# EAGLE design Codeshelf-0007.v03 (EAGLE 6.5.0)
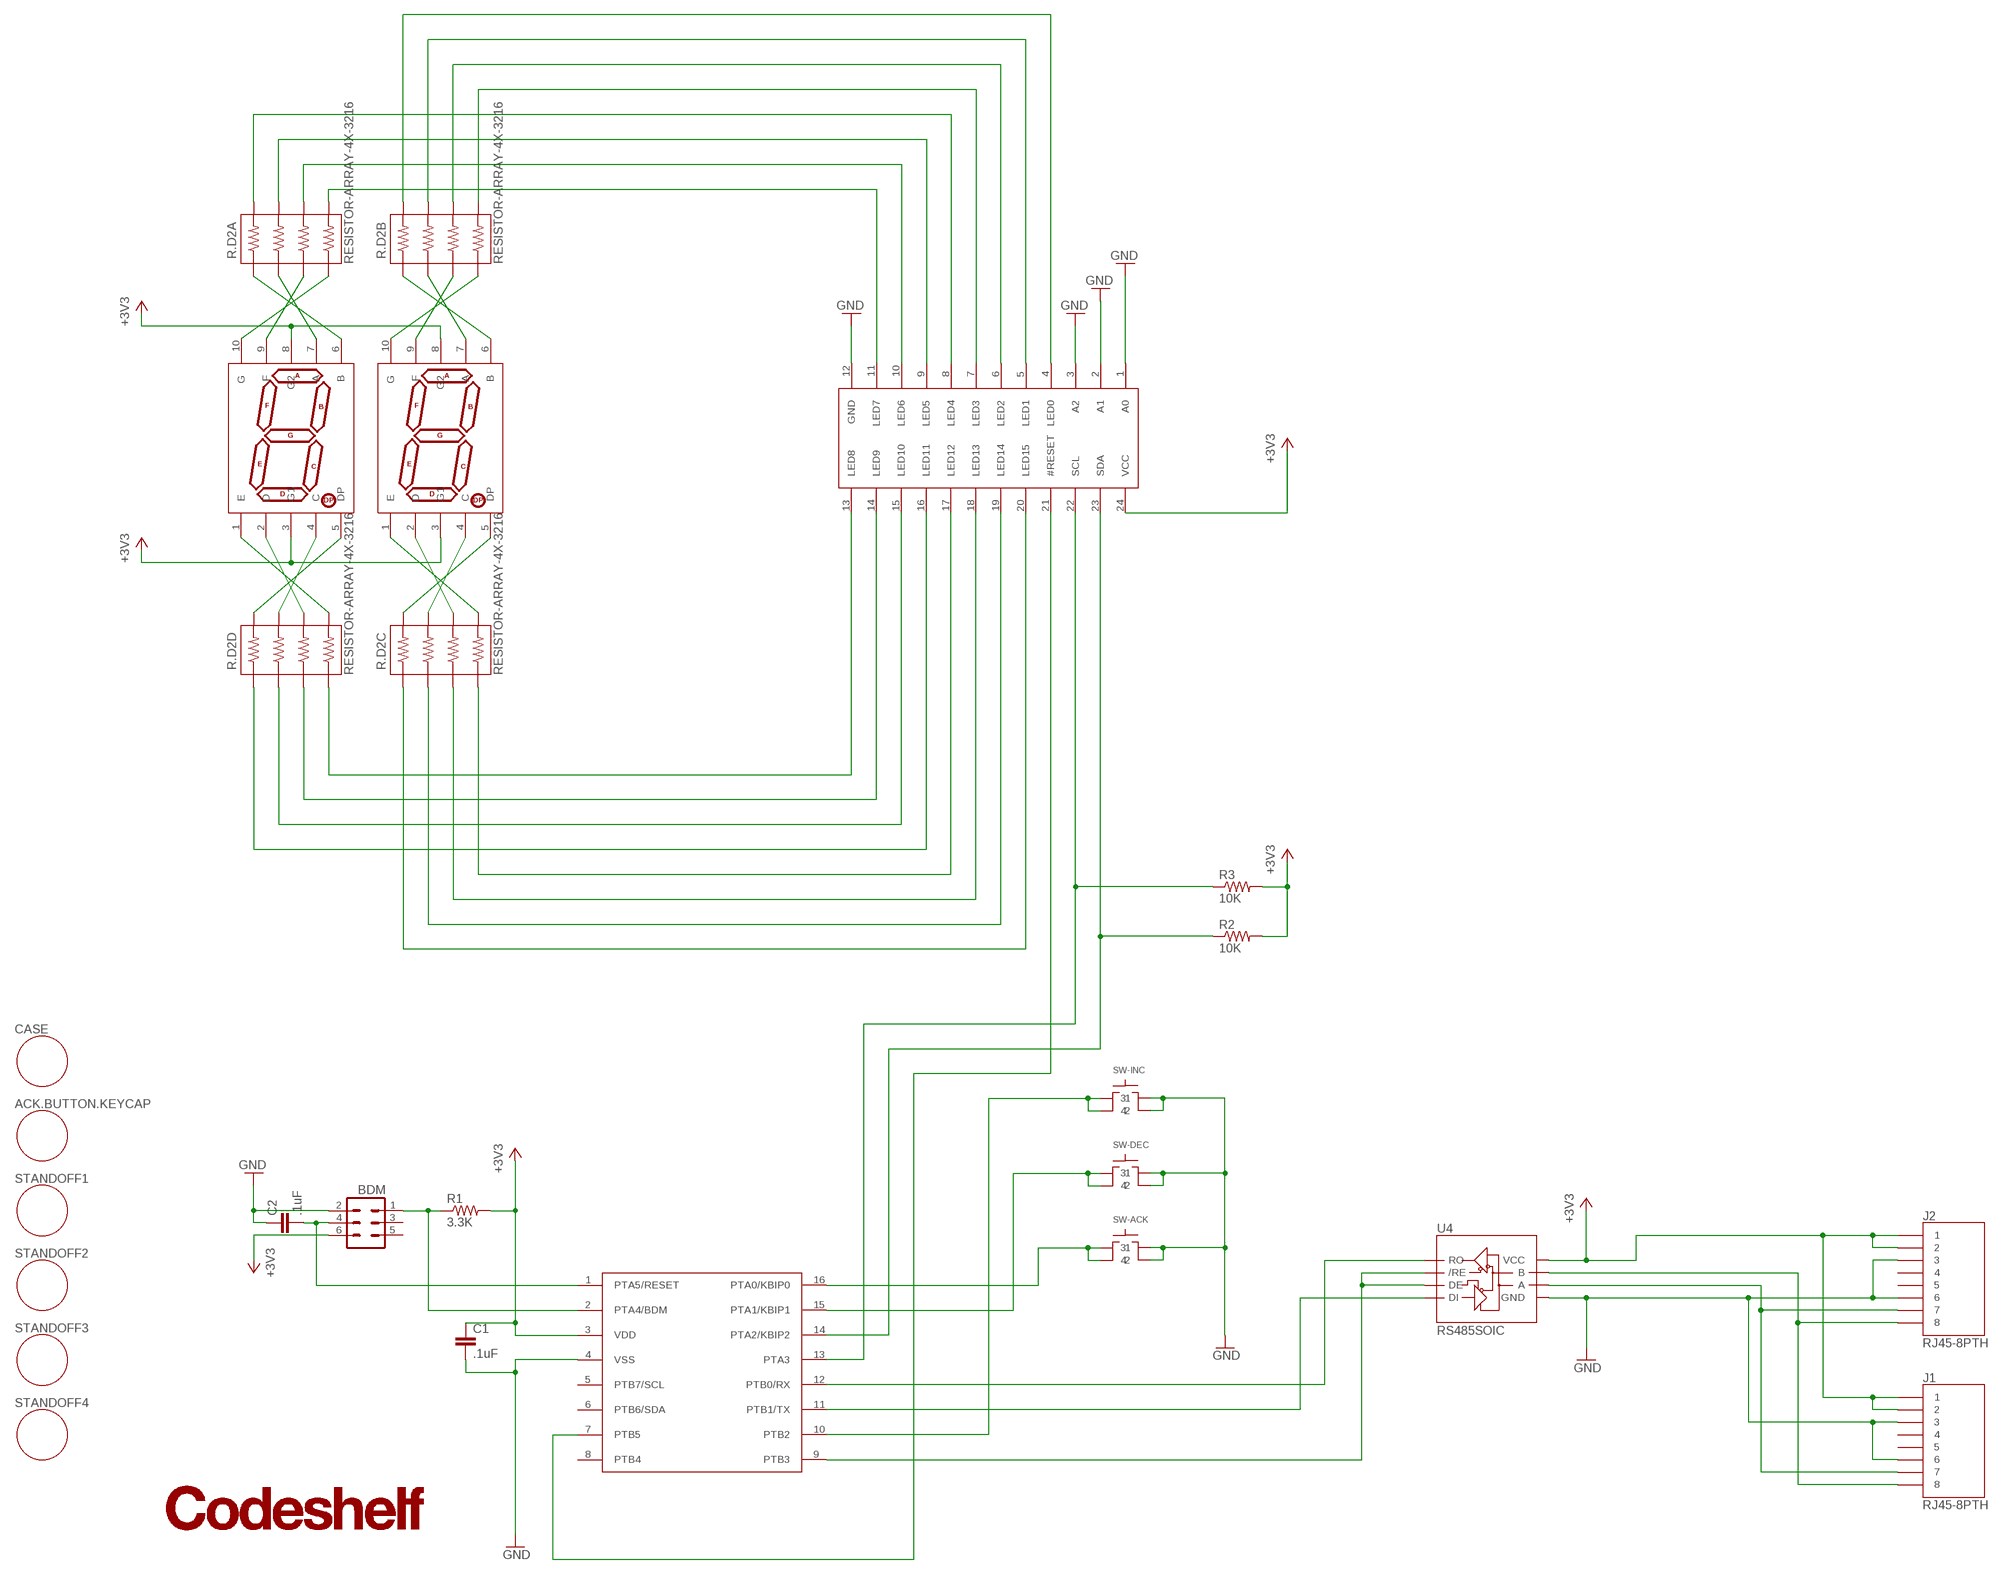
[diagram p0: schematic, sheet 1]

## Parts
ACK.BUTTON.KEYCAP  EXTERNAL-COMPONENT  [EXTERNAL-COMPONENT]
BDM  HEADER-3X2  [HEADER-3X2]
C1  .1uF  RF-C0402  [C0402]
C2  .1uF  RF-C0402  [C0402]
CASE  EXTERNAL-COMPONENT  [EXTERNAL-COMPONENT]
J1  RJ45-8PTH  [RJ45-8]
J2  RJ45-8PTH  [RJ45-8]
LED1  7SEGMENT-1DIGITSMD  [7SEGMENT-1DIG-.40-SMD]
LED2  7SEGMENT-1DIGITSMD  [7SEGMENT-1DIG-.40-SMD]
LOGO  CODESHELF-LOGO  [CODESHELF-LOGO]
R1  3.3K  RF-R0402  [RF-R0402]
R2  10K  RF-R0402  [RF-R0402]
R3  10K  RF-R0402  [RF-R0402]
R.D2A  RESISTOR-ARRAY-4X-3216  [3216-4X]
R.D2B  RESISTOR-ARRAY-4X-3216  [3216-4X]
R.D2C  RESISTOR-ARRAY-4X-3216  [3216-4X]
R.D2D  RESISTOR-ARRAY-4X-3216  [3216-4X]
STANDOFF1  EXTERNAL-COMPONENT  [EXTERNAL-COMPONENT]
STANDOFF2  EXTERNAL-COMPONENT  [EXTERNAL-COMPONENT]
STANDOFF3  EXTERNAL-COMPONENT  [EXTERNAL-COMPONENT]
STANDOFF4  EXTERNAL-COMPONENT  [EXTERNAL-COMPONENT]
SW-ACK  SWITCH-TACTILE-320.03E11  [SWITCH-TACTILE-320.03E11]
SW-DEC  SWITCH-TACTILE-FSM  [SWITCH-TACTILE-FSM]
SW-INC  SWITCH-TACTILE-FSM  [SWITCH-TACTILE-FSM]
U2  MC9S08QG-DT  [TSSOP16]
U3  CAT9552  [TSSOP24]
U4  RS485SOIC  [SO08]

## Nets
+3V3 [+3V3]: BDM.6 C1.1 J1.1 J1.2 J2.1 J2.2 LED1.3(G1) LED1.8(G2) LED2.3(G1) LED2.8(G2) R1.2 R2.2 R3.2 U2.3(VDD) U3.24(VCC) U4.8(VCC)
GND [GND]: BDM.2 C1.2 C2.1 J1.3 J1.6 J2.3 J2.6 SW-ACK.P$3 SW-ACK.P$4 SW-DEC.P$3 SW-DEC.P$4 SW-INC.P$3 SW-INC.P$4 U2.4(VSS) U3.1(A0) U3.2(A1) U3.3(A2) U3.12(GND) U4.5(GND)
N$1: R.D2A.5(4B) U3.11(LED7)
N$2: R.D2A.6(3B) U3.10(LED6)
N$3: R.D2A.7(2B) U3.9(LED5)
N$4: R.D2A.8(1B) U3.8(LED4)
N$5: R.D2B.5(4B) U3.7(LED3)
N$6: SW-ACK.P$1 SW-ACK.P$2 U2.16(PTA0/KBIP0)
N$7: SW-DEC.P$1 SW-DEC.P$2 U2.15(PTA1/KBIP1)
N$8: SW-INC.P$1 SW-INC.P$2 U2.10(PTB2)
N$9: BDM.1 R1.1 U2.2(PTA4/BDM)
N$10: R.D2B.6(3B) U3.6(LED2)
N$11: R.D2B.7(2B) U3.5(LED1)
N$12: R.D2B.8(1B) U3.4(LED0)
N$13: LED2.6(B) R.D2A.1(1A)
N$14: LED2.7(A) R.D2A.2(2A)
N$15: LED2.9(F) R.D2A.3(3A)
N$16: LED2.10(G) R.D2A.4(4A)
N$17: LED2.5(DP) R.D2D.8(1B)
N$18: LED2.4(C) R.D2D.7(2B)
N$19: U2.9(PTB3) U4.2(/RE) U4.3(DE)
N$20: LED2.2(D) R.D2D.6(3B)
N$21: LED2.1(E) R.D2D.5(4B)
N$22: LED1.6(B) R.D2B.1(1A)
N$23: BDM.4 C2.2 U2.1(PTA5/RESET)
N$24: LED1.7(A) R.D2B.2(2A)
N$25: LED1.9(F) R.D2B.3(3A)
N$26: LED1.10(G) R.D2B.4(4A)
N$27: LED1.5(DP) R.D2C.8(1B)
N$28: LED1.4(C) R.D2C.7(2B)
N$29: LED1.2(D) R.D2C.6(3B)
N$30: LED1.1(E) R.D2C.5(4B)
N$31: R.D2D.4(4A) U3.13(LED8)
N$32: R.D2D.3(3A) U3.14(LED9)
N$33: R.D2D.2(2A) U3.15(LED10)
N$34: R.D2D.1(1A) U3.16(LED11)
N$35: R.D2C.4(4A) U3.17(LED12)
N$36: R.D2C.3(3A) U3.18(LED13)
N$37: R.D2C.2(2A) U3.19(LED14)
N$38: R.D2C.1(1A) U3.20(LED15)
RESET: U2.7(PTB5) U3.21(#RESET)
RS485_N: J1.8 J2.8 U4.7(B)
RS485_P: J1.7 J2.7 U4.6(A)
RX: U2.12(PTB0/RX) U4.1(RO)
SLA: R2.1 U2.14(PTA2/KBIP2) U3.23(SDA)
SLC: R3.1 U2.13(PTA3) U3.22(SCL)
TX: U2.11(PTB1/TX) U4.4(DI)
Unconnected: BDM.3 BDM.5 J1.4 J1.5 J2.4 J2.5 U2.5(PTB7/SCL) U2.6(PTB6/SDA) U2.8(PTB4)

## Library data of the parts
ACK.BUTTON.KEYCAP = GW-devices:EXTERNAL-COMPONENT: Use this device to note external components needed for the BOM; MFGN: ESwitch; MFGP: 320.08RED; PRICE: 0.87
BDM = GW-devices:HEADER-3X2
C1 C2 = GW-devices:RF-C: RF capacitor pads for FSL reference design; MFGN: Murata; MFGP: GRM155R61C104KA88D; PRICE: 0.02
CASE = GW-devices:EXTERNAL-COMPONENT: Use this device to note external components needed for the BOM; MFGN: Bud Industries; MFGP: PN-1321-C; PRICE: 8.50
J1 = GW-devices:RJ45-8: RJ45 Jack MFG part number 54602-908lf; MFGN: FCI; MFGP: 54602-908LF; PRICE: 0.02
J2 = GW-devices:RJ45-8: RJ45 Jack MFG part number 54602-908lf; MFGN: FCI; MFGP: 54602-908LF; PRICE: 0.57
LED1 LED2 = GW-devices:7SEGMENT-1DIGIT
LOGO = GW-devices:CODESHELF-LOGO
R1 = GW-devices:RF-R: RF resistor pads for FSL reference design; MFGN: Panasonic; MFGP: ERJ-2GEJ332X; PRICE: 0.02
R2 R3 = GW-devices:RF-R: RF resistor pads for FSL reference design; MFGN: Panasonic; MFGP: ERJ-2GEJ103X; PRICE: 0.02
R.D2A R.D2B R.D2C R.D2D = GW-devices:RESISTOR-ARRAY-4X; MFGN: Yageo; MFGP: YC164-JR-07120RL; PRICE: 0.006
STANDOFF1-STANDOFF4 = GW-devices:EXTERNAL-COMPONENT: Use this device to note external components needed for the BOM; MFGN: Keystone; MFGP: 24340; PRICE: 0.44
SW-ACK = GW-devices:SWITCH-TACTILE; MFGN: ESwitch; MFGP: 320.03E11
SW-DEC SW-INC = GW-devices:SWITCH-TACTILE; MFGN: TE Connectivity; MFGP: FSM16JH; PRICE: 0.18
U2 = GW-devices:MC9S08QG; MFGN: Freescale; MFGP: MC9S08QG8CDTER; PRICE: 1.73
U3 = GW-devices:CAT9552; MFGN: On Semiconductor; MFGP: CAT9552YI-T2; PRICE: 1.28
U4 = SparkFun:RS485; MFGN: TI; MFGP: SN65HVD1781DR; PRICE: 4.29

## Net classes
1 +3V3: width 0.3 mm
2 GND: width 0.3 mm
3 RS485: width 0.4 mm

## Board
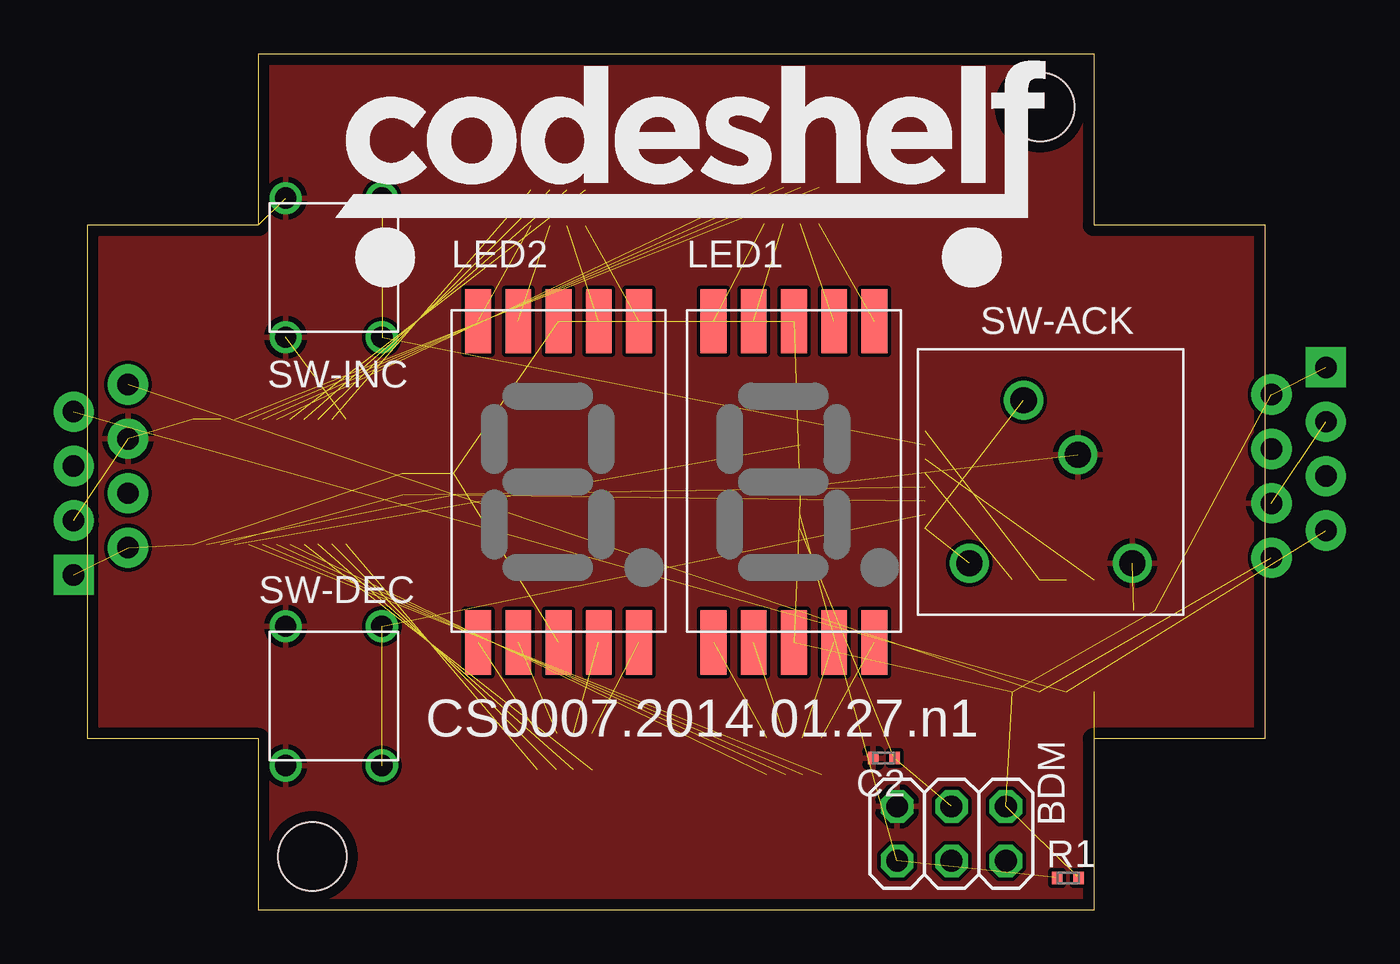
[diagram p1: board, top side]
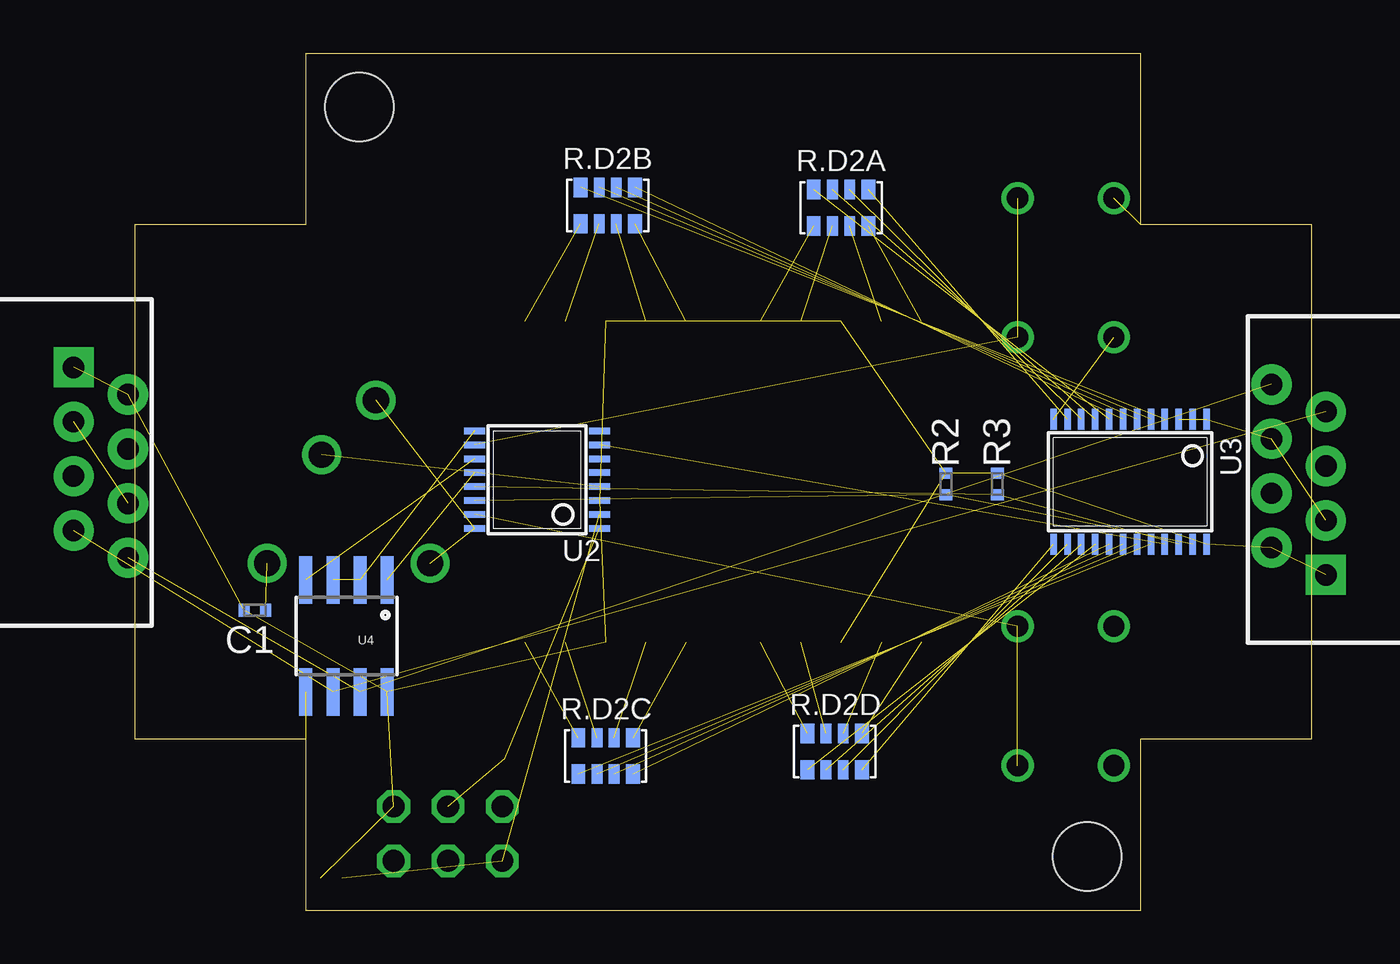
[diagram p2: board, bottom side, seen from below]

Size 55 x 40 mm. Coordinates in mm from the lower left corner, seen from the top.
Outline: 0,8 0,32 8,32 8,40 47,40 47,32 55,32 55,8 47,8 47,0 8,0 8,8 0,8
Copper layers (1*16): Top 0.0356mm / dielectric 1.5011mm / Bottom 0.0356mm
Design rules "SilverCircuits": minimum track width 7mil, minimum drill 14mil, track to track 7mil, track to pad 7mil, pad to pad 7mil, via to via 7mil, smd to smd 0mil, copper to edge 20mil, drill to drill 8mil, minimum pad ring 10mil, minimum via ring 8mil, stop-mask expansion 4mil, vias tented up to drill 0mil, thermal gap 10mil
Holes 3.2 mm at 10.5,2.5 44.5,37.5

### Footprints (pad centres in the part's own frame; a part is rotated, then mirrored left to right if it is on the bottom)
HEADER-3X2 = drill 1.016 octagon: 1 -5.08,0; 2 -5.08,2.54; 3 -2.54,0; 4 -2.54,2.54; 5 0,0; 6 0,2.54
C0402 = smd 0.5 x 0.6: 1 -0.5,0; 2 0.5,0
RJ45-8 = drill 1 pad 1.88 square: 1 -4.445,6.35 | drill 1 pad 1.88: 2 -3.175,8.89; 3 -1.905,6.35; 4 -0.635,8.89; 5 0.635,6.35; 6 1.905,8.89; 7 3.175,6.35; 8 4.445,8.89 | hole 3.2: -5.715,0; 5.715,0
7SEGMENT-1DIG-.40-SMD = smd 1.2 x 3: 1 -3.76,-7.5; 2 -1.88,-7.5; 3 0,-7.5; 4 1.88,-7.5; 5 3.76,-7.5; 6 3.76,7.5; 7 1.88,7.5; 8 0,7.5; 9 -1.88,7.5; 10 -3.76,7.5
RF-R0402 = smd 0.5 x 0.6: 1 -0.5,0; 2 0.5,0
3216-4X = smd 0.65 x 0.9: 1 -1.275,-0.85; 4 1.275,-0.85; 5 1.275,0.85; 8 -1.275,0.85 | smd 0.5 x 0.9: 2 -0.4,-0.85; 3 0.4,-0.85; 6 0.4,0.85; 7 -0.4,0.85
SWITCH-TACTILE-320.03E11 = drill 1.22: P$1 -3.81,-3.81; P$2 -1.27,3.81; P$3 1.27,1.27; P$4 3.81,-3.81
SWITCH-TACTILE-FSM = drill 0.99: P$1 -3.25,2.25; P$2 3.25,2.25; P$3 -3.25,-2.25; P$4 3.25,-2.25
TSSOP16 = smd 0.305 x 0.991: 1 -2.275,-2.918; 2 -1.625,-2.918; 3 -0.975,-2.918; 4 -0.325,-2.918; 5 0.325,-2.918; 6 0.975,-2.918; 7 1.625,-2.918; 8 2.275,-2.918; 9 2.275,2.918; 10 1.625,2.918; 11 0.975,2.918; 12 0.325,2.918; 13 -0.325,2.918; 14 -0.975,2.918; 15 -1.625,2.918; 16 -2.275,2.918
TSSOP24 = smd 0.305 x 0.991: 1 -3.575,-2.918; 2 -2.925,-2.918; 3 -2.275,-2.918; 4 -1.625,-2.918; 5 -0.975,-2.918; 6 -0.325,-2.918; 7 0.325,-2.918; 8 0.975,-2.918; 9 1.625,-2.918; 10 2.275,-2.918; 11 2.925,-2.918; 12 3.575,-2.918; 13 3.575,2.918; 14 2.925,2.918; 15 2.275,2.918; 16 1.625,2.918; 17 0.975,2.918; 18 0.325,2.918; 19 -0.325,2.918; 20 -0.975,2.918; 21 -1.625,2.918; 22 -2.275,2.918; 23 -2.925,2.918; 24 -3.575,2.918
SO08 = smd 0.61 x 2.21: 1 -1.905,-2.616; 2 -0.635,-2.616; 3 0.635,-2.616; 4 1.905,-2.616; 5 1.905,2.616; 6 0.635,2.616; 7 -0.635,2.616; 8 -1.905,2.616

### Placement (x,y rotation side)
ACK.BUTTON.KEYCAP  -3.7,35.7 0 top  (outside the outline)
BDM  42.9,2.3 0 top
C1  49.38,14 0 bottom
C2  37.2,7.1 0 top
CASE  -2.1,37.4 0 top
J1  64.2,20.9 270 bottom
J2  -7,20.1 90 bottom
LED1  33,20 0 top
LED2  22,20 0 top
LOGO  11.6,29.1 0 top
R1  45.8,1.5 0 top
R2  17.1,19.9 90 bottom
R3  14.7,19.9 90 bottom
R.D2A  22,32.8 0 bottom
R.D2B  32.9,32.9 0 bottom
R.D2C  33,7.2 0 bottom
R.D2D  22.3,7.4 0 bottom
STANDOFF1  -5.3,34 0 top  (outside the outline)
STANDOFF2  -6.9,32.3 0 top  (outside the outline)
STANDOFF3  -7.9,31.2 0 top  (outside the outline)
STANDOFF4  -10.7,32.5 0 top  (outside the outline)
SW-ACK  45,20 0 top
SW-DEC  11.5,10 270 top
SW-INC  11.5,30 270 top
U2  36.2,20.1 90 bottom
U3  8.5,20 180 bottom
U4  45.1,12.8 180 bottom

### Tracks (layer width: path | path; a pad name or v marks a point on that pad's centre or on a via)
+3V3  (15 unrouted)
GND  (10 unrouted)
  Bottom 0: 8,8 0,8 0,32 8,32 8,40 47,40 47,32 55,32 55,8 47,8 47,0 8,0 8,8
  pour Top: 8,8 0,8 0,32 8,32 8,40 47,40 47,32 55,32 55,8 47,8 47,0 8,0 8,7.9 8.1,7.9
N$1  (1 unrouted)
N$2  (1 unrouted)
N$3  (1 unrouted)
N$4  (1 unrouted)
N$5  (1 unrouted)
N$6  (2 unrouted)
N$7  (2 unrouted)
N$8  (2 unrouted)
N$9  (2 unrouted)
N$10  (1 unrouted)
N$11  (1 unrouted)
N$12  (1 unrouted)
N$13  (1 unrouted)
N$14  (1 unrouted)
N$15  (1 unrouted)
N$16  (1 unrouted)
N$17  (1 unrouted)
N$18  (1 unrouted)
N$19  (2 unrouted)
N$20  (1 unrouted)
N$21  (1 unrouted)
N$22  (1 unrouted)
N$23  (2 unrouted)
N$24  (1 unrouted)
N$25  (1 unrouted)
N$26  (1 unrouted)
N$27  (1 unrouted)
N$28  (1 unrouted)
N$29  (1 unrouted)
N$30  (1 unrouted)
N$31  (1 unrouted)
N$32  (1 unrouted)
N$33  (1 unrouted)
N$34  (1 unrouted)
N$35  (1 unrouted)
N$36  (1 unrouted)
N$37  (1 unrouted)
N$38  (1 unrouted)
RESET  (1 unrouted)
RS485_N  (2 unrouted)
RS485_P  (2 unrouted)
RX  (1 unrouted)
SLA  (2 unrouted)
SLC  (2 unrouted)
TX  (1 unrouted)

### Text on the board
tPlace: CS0007.2014.01.27.n1